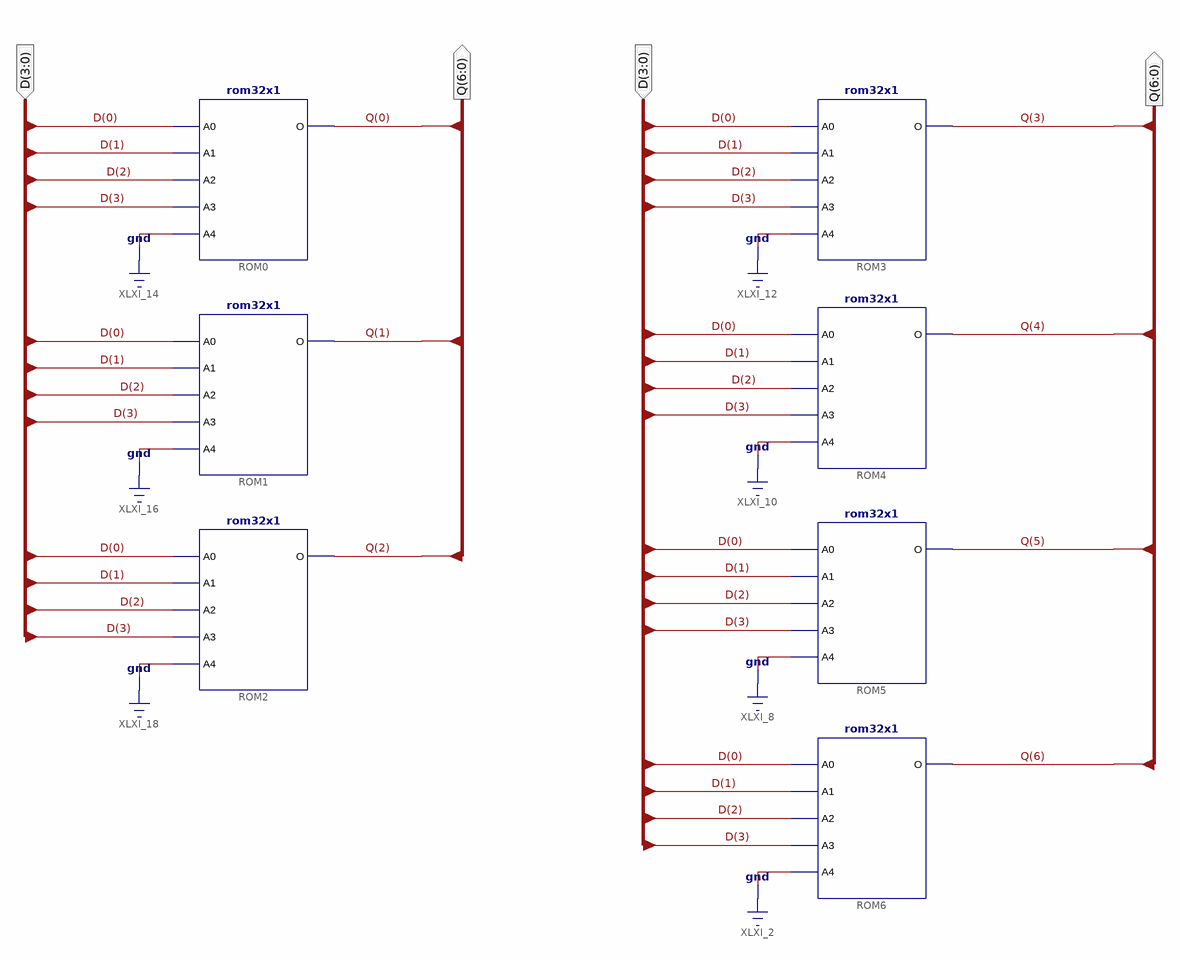
[diagram p0: schematic sheet 1]
// Xilinx ISE schematic my_rom.sch (virtex6) as structural Verilog: 7 symbols, 2 ports
module my_rom (
  input  [3:0] D,
  output [6:0] Q
);

  rom32x1 #(.INIT("00000000")) ROM4 (.A0(D[0]), .A1(D[1]), .A2(D[2]), .A3(D[3]), .A4(1'b0), .O(Q[4]));
  rom32x1 #(.INIT("00000000")) ROM5 (.A0(D[0]), .A1(D[1]), .A2(D[2]), .A3(D[3]), .A4(1'b0), .O(Q[5]));
  rom32x1 #(.INIT("00000000")) ROM6 (.A0(D[0]), .A1(D[1]), .A2(D[2]), .A3(D[3]), .A4(1'b0), .O(Q[6]));
  rom32x1 #(.INIT("00000000")) ROM3 (.A0(D[0]), .A1(D[1]), .A2(D[2]), .A3(D[3]), .A4(1'b0), .O(Q[3]));
  rom32x1 #(.INIT("00000000")) ROM0 (.A0(D[0]), .A1(D[1]), .A2(D[2]), .A3(D[3]), .A4(1'b0), .O(Q[0]));
  rom32x1 #(.INIT("00000000")) ROM1 (.A0(D[0]), .A1(D[1]), .A2(D[2]), .A3(D[3]), .A4(1'b0), .O(Q[1]));
  rom32x1 #(.INIT("00000000")) ROM2 (.A0(D[0]), .A1(D[1]), .A2(D[2]), .A3(D[3]), .A4(1'b0), .O(Q[2]));
endmodule
